# Altium project e3_tp2_ej4_altium.PrjPcb
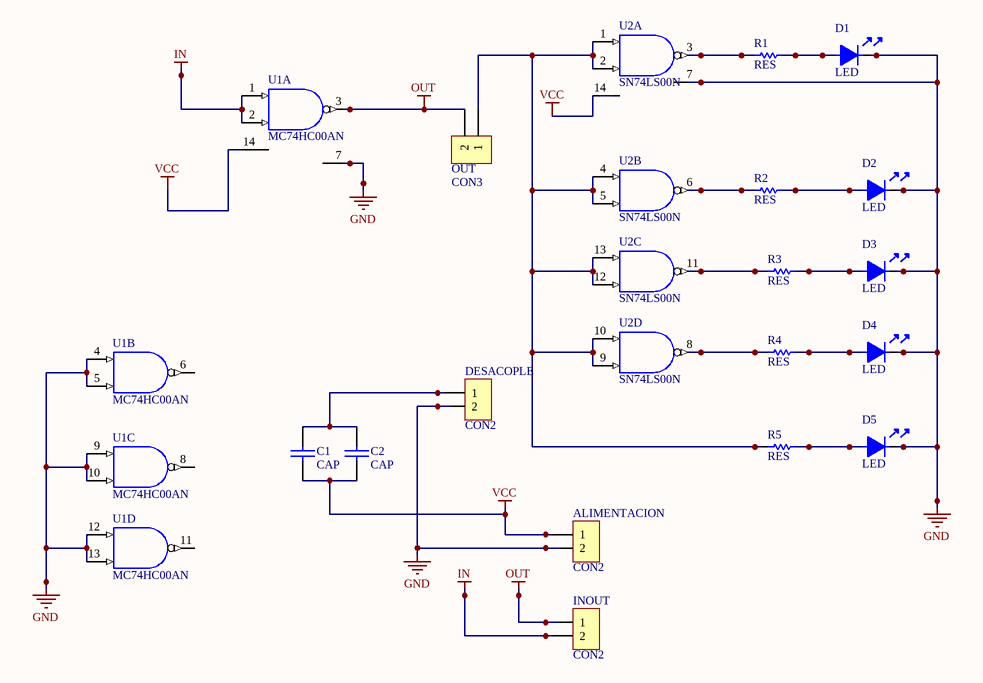
[diagram p0: e3_tp2_ej4.SchDoc]
1 sheet, 18 parts. Net scope: global (net labels, ports and power ports of the same name join across sheets).
Board file: e3_tp2_ej4.PcbDoc

## Sheet e3_tp2_ej4.SchDoc
size A

### Parts
ALIMENTACION  CON2  [SIP2]
C1  CAP  [CAP200]
C2  CAP  [CAP200]
D1  LED  [LED3]
D2  LED  [LED3]
D3  LED  [LED3]
D4  LED  [LED3]
D5  LED  [LED3]
DESACOPLE  CON2  [SIP2]
INOUT  CON2  [SIP2]
OUT  CON3  [SIP2]
R1  RES  [RES300]
R2  RES  [RES300]
R3  RES  [RES300]
R4  RES  [RES300]
R5  RES  [RES300]
U1  MC74HC00AN  [646-06]  (parts A,B,C,D of 4)
U2  SN74LS00N  [646-06]  (parts A,B,C,D of 4)

### Nets
GND: ALIMENTACION.2 D1.2 D2.2 D3.2 D4.2 D5.2 DESACOPLE.2 U1.4(A) U1.5(B) U1.7(GND) U1.9(A) U1.10(B) U1.12(A) U1.13(B) U2.7(GND)
IN: INOUT.2 U1.1(A) U1.2(B)
OUT: INOUT.1 OUT.2 U1.3(~{Y})
VCC: ALIMENTACION.1 C1.2 C2.2 U1.14(VCC) U2.14(VCC)
NetC1_1: C1.1 C2.1 DESACOPLE.1
NetD1_1: D1.1 R1.2
NetD2_1: D2.1 R2.2
NetD3_1: D3.1 R3.2
NetD4_1: D4.1 R4.2
NetD5_1: D5.1 R5.2
NetOUT_1: OUT.1 R5.1 U2.1(A) U2.2(B) U2.4(A) U2.5(B) U2.9(B) U2.10(A) U2.12(B) U2.13(A)
NetR1_1: R1.1 U2.3(~{O})
NetR2_1: R2.1 U2.6(~{O})
NetR3_1: R3.1 U2.11(~{O})
NetR4_1: R4.1 U2.8(~{O})

Not connected (* = marked no-connect by the designer): U1 6(~{Y}) 8(~{Y}) 11(~{Y})

### Library data of the parts
OUT = CON2
U1 = MC74HC00AN: Quad 2-Input NAND Gate; Published: 15-Apr-2002; DatasheetVersion: Mar-2000; PackageVersion: 1995; PackageReference: 646-06; Publisher: Altium Limited; PackageDescription: DIP; 14 Leads; Row Spacing 7.62 mm; Pitch 2.54 mm; ComponentLink1Description: Manufacturer Link; ComponentLink1URL: http://www.onsemi.com/; ComponentLink2Description: Datasheet; ComponentLink2URL: http://www.onsemi.com/pub/Collateral/MC74HC00A-D.PDF
U2 = SN74LS00N: Quad 2-Input NAND Gate; ComponentAvailability: Not for New Design; Published: 15-Apr-2002; DatasheetVersion: Dec-1999; PackageVersion: 1995; PackageReference: 646-06; Publisher: Altium Limited; PackageDescription: DIP; 14 Leads; Row Spacing 7.62 mm; Pitch 2.54 mm; ComponentLink1Description: Manufacturer Link; ComponentLink1URL: http://www.onsemi.com/; ComponentLink2Description: Datasheet; ComponentLink2URL: http://www.onsemi.com/pub/Collateral/SN74LS00-D.PDF